# EAGLE design SensorStick (EAGLE 9.6.2)
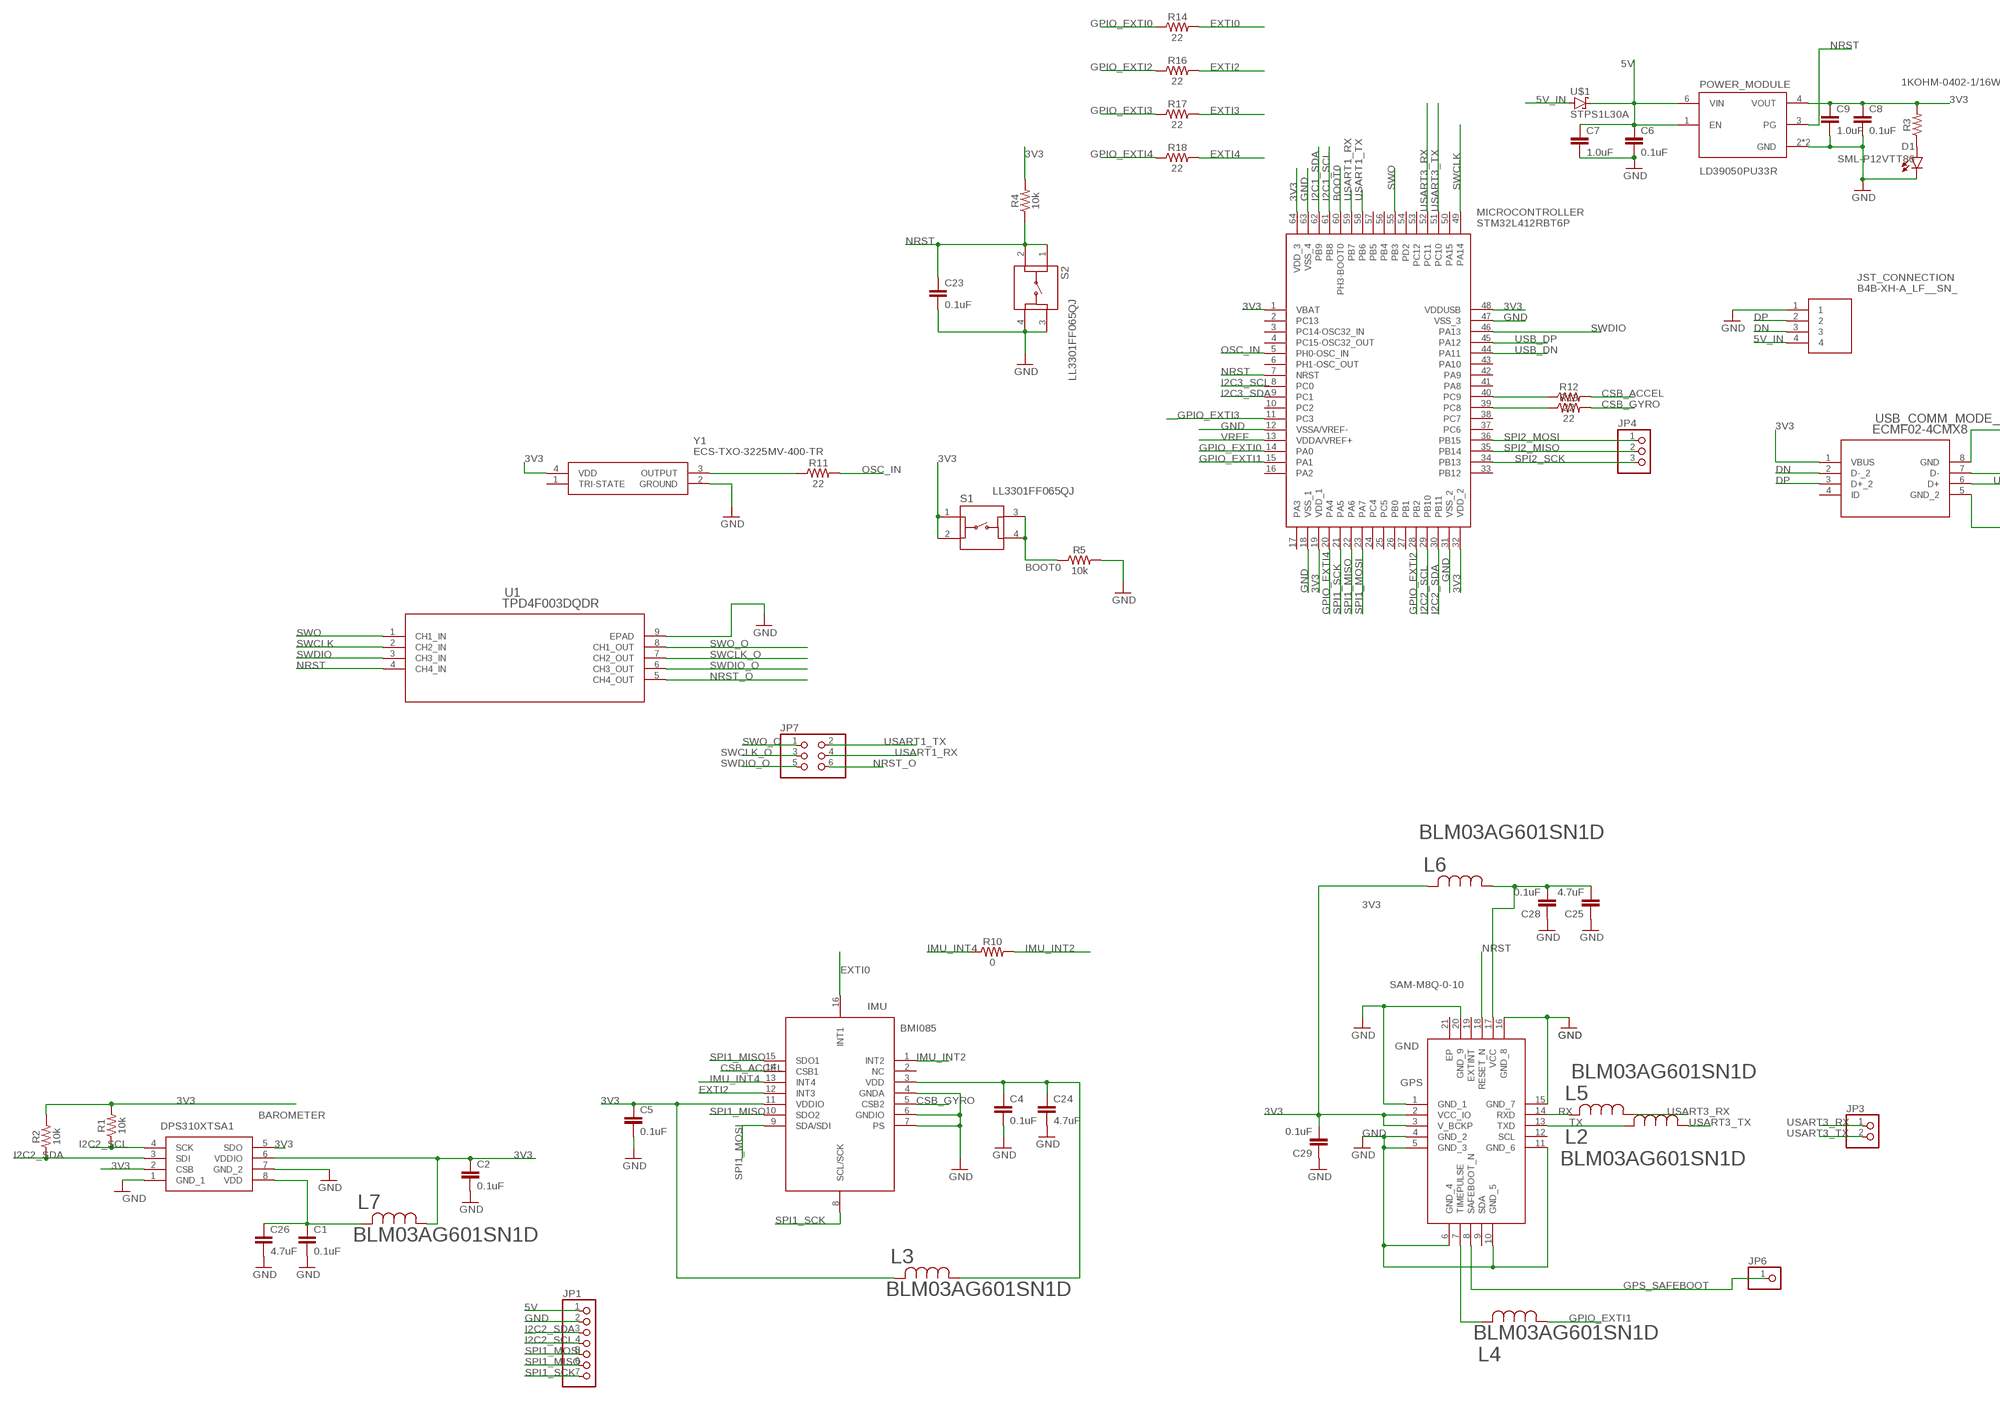
[diagram p0: schematic, sheet 1, part 1 of 2]
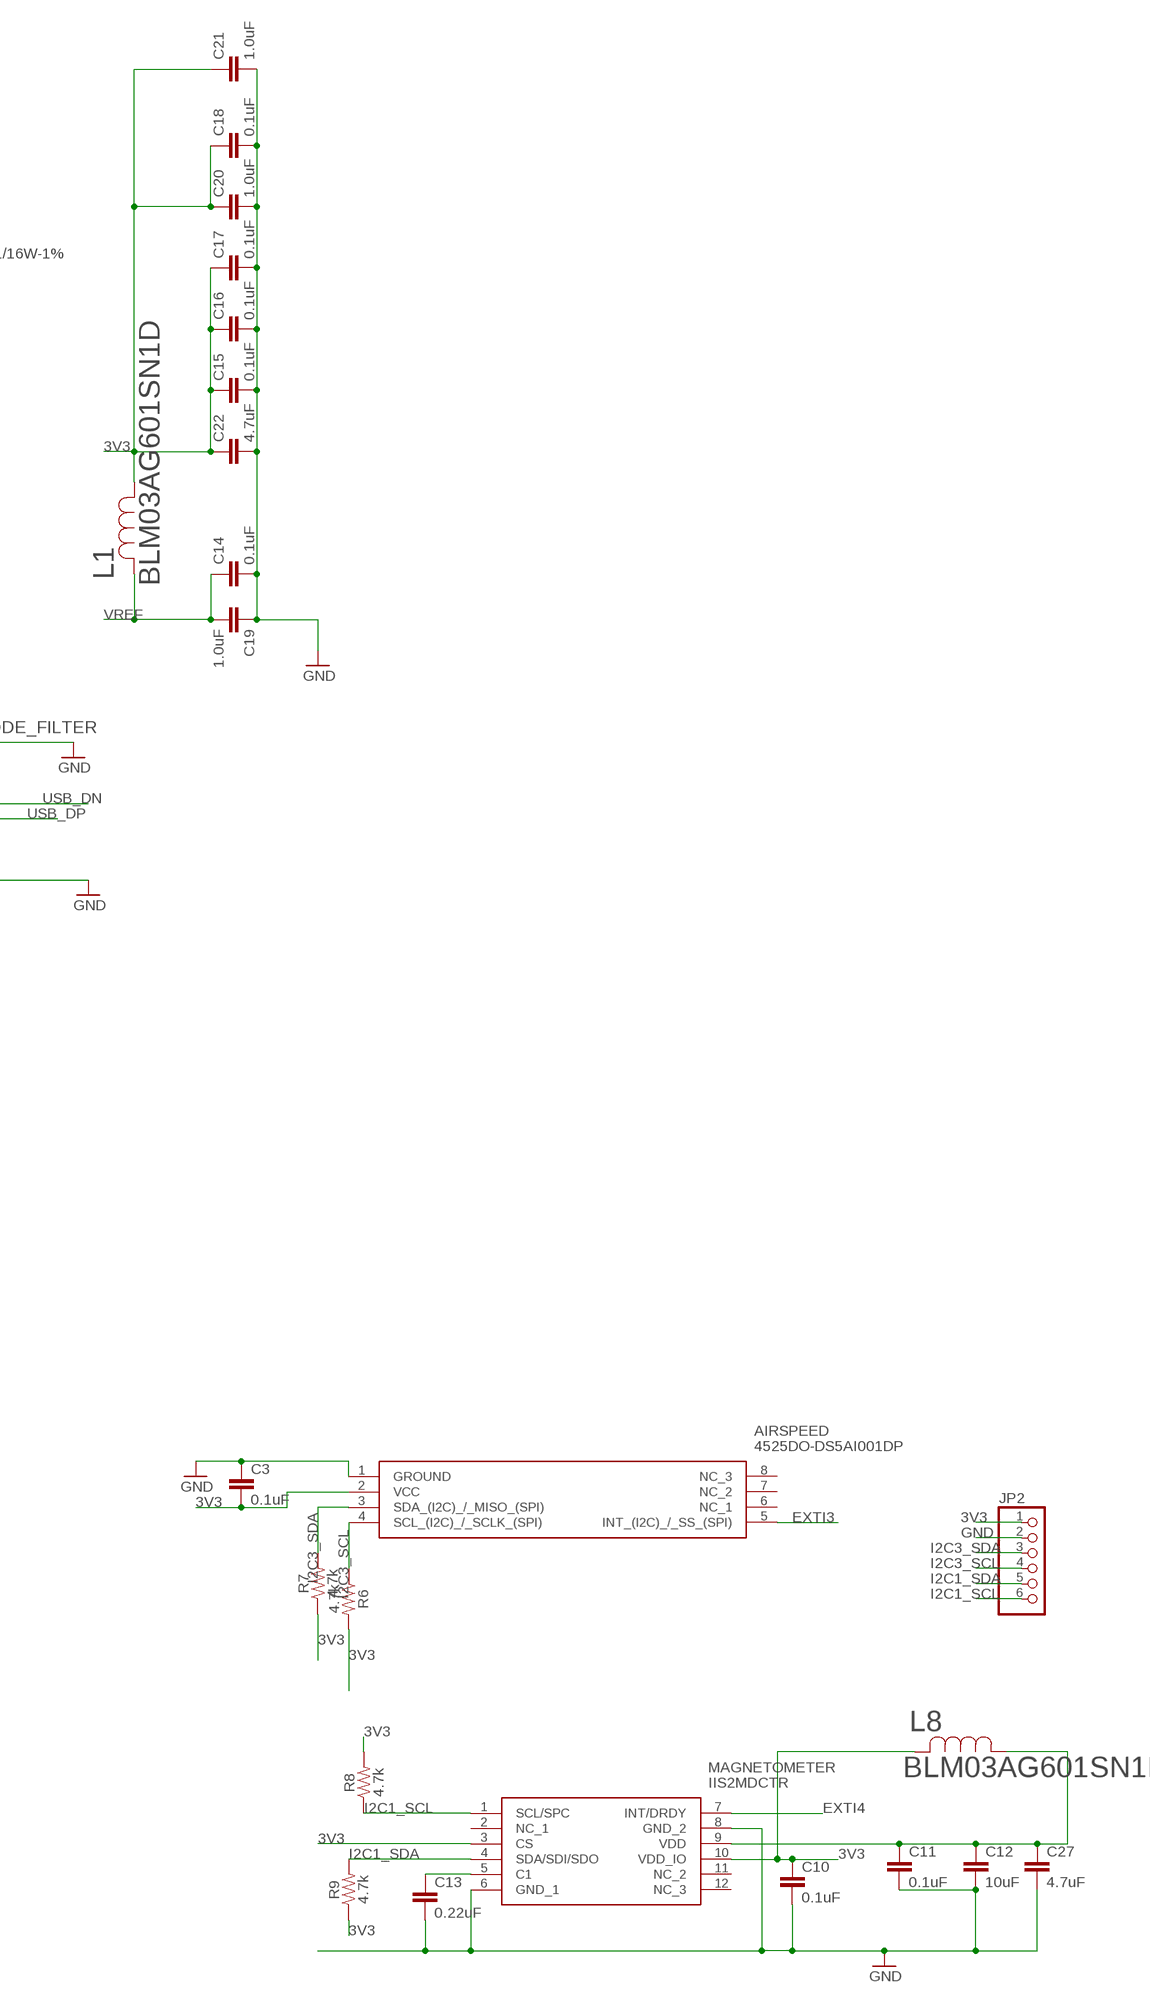
[diagram p1: schematic, sheet 1, part 2 of 2]

## Parts
AIRSPEED  4525DO-DS5AI001DP  [4525DO-DS...P]
BAROMETER  DPS310XTSA1  [DPS310XTSA1]
C1  0.1uF  0.1UF-0402-6.3V-10%-X7R  [0402]
C2  0.1uF  0.1UF-0402-6.3V-10%-X7R  [0402]
C3  0.1uF  0.1UF-0402-6.3V-10%-X7R  [0402]
C4  0.1uF  0.1UF-0402-6.3V-10%-X7R  [0402]
C5  0.1uF  0.1UF-0402-6.3V-10%-X7R  [0402]
C6  0.1uF  0.1UF-0402-6.3V-10%-X7R  [0402]
C7  1.0uF  1.0UF-0402-16V-10%  [0402]
C8  0.1uF  0.1UF-0402-6.3V-10%-X7R  [0402]
C9  1.0uF  1.0UF-0402-16V-10%  [0402]
C10  0.1uF  0.1UF-0402-6.3V-10%-X7R  [0402]
C11  0.1uF  0.1UF-0402-6.3V-10%-X7R  [0402]
C12  10uF  10UF-0603-6.3V-20%  [0603]
C13  0.22uF  0.22UF-0603-25V-10%  [0603]
C14  0.1uF  0.1UF-0603-25V-5%  [0603]
C15  0.1uF  0.1UF-0603-25V-5%  [0603]
C16  0.1uF  0.1UF-0603-25V-5%  [0603]
C17  0.1uF  0.1UF-0603-25V-5%  [0603]
C18  0.1uF  0.1UF-0603-25V-5%  [0603]
C19  1.0uF  1.0UF-0805-25V-10%  [0805]
C20  1.0uF  1.0UF-0805-25V-10%  [0805]
C21  1.0uF  1.0UF-0805-25V-10%  [0805]
C22  4.7uF  4.7UF0603  [0603]
C23  0.1uF  0.1UF-0603-25V-5%  [0603]
C24  4.7uF  4.7UF0603  [0603]
C25  4.7uF  4.7UF0603  [0603]
C26  4.7uF  4.7UF0603  [0603]
C27  4.7uF  4.7UF0603  [0603]
C28  0.1uF  0.1UF-0402-16V-10%  [0402]
C29  0.1uF  0.1UF-0402-16V-10%  [0402]
D1  SML-P12VTT86  [LED_SML-P11UTT86R]
GPS  SAM-M8Q-0-10  [SAMM8Q010]
IMU  BMI085  [BMI085]
JP1  PINHD-1X7  [1X07]
JP2  PINHD-1X6  [1X06]
JP3  PINHD-1X2  [1X02]
JP4  PINHD-1X3  [1X03]
JP6  PINHD-1X1  [1X01]
JP7  PINHD-2X3  [2X03]
JST_CONNECTION  B4B-XH-A_LF__SN_  [B4BXHALFSN]
L1  BLM03AG601SN1D  [IND_BLM03_0201_MUR]
L2  BLM03AG601SN1D  [IND_BLM03_0201_MUR]
L3  BLM03AG601SN1D  [IND_BLM03_0201_MUR]
L4  BLM03AG601SN1D  [IND_BLM03_0201_MUR]
L5  BLM03AG601SN1D  [IND_BLM03_0201_MUR]
L6  BLM03AG601SN1D  [IND_BLM03_0201_MUR]
L7  BLM03AG601SN1D  [IND_BLM03_0201_MUR]
L8  BLM03AG601SN1D  [IND_BLM03_0201_MUR]
MAGNETOMETER  IIS2MDCTR  [IIS2MDCTR]
MICROCONTROLLER  STM32L412RBT6P  [QFP50P1200X1200X160-64N]
POWER_MODULE  LD39050PU33R  [SON95P300X300X100-7N]
R1  10k  10KOHM-0402-1/16W-1%  [0402]
R2  10k  10KOHM-0402-1/16W-1%  [0402]
R3  1KOHM-0402-1/16W-1%  [0402]
R4  10k  10KOHM-0603-1/10W-1%  [0603]
R5  10k  10KOHM-0603-1/10W-1%  [0603]
R6  4.7k  4.7KOHM-0603-1/10W-1%  [0603]
R7  4.7k  4.7KOHM-0603-1/10W-1%  [0603]
R8  4.7k  4.7KOHM-0603-1/10W-1%  [0603]
R9  4.7k  4.7KOHM-0603-1/10W-1%  [0603]
R10  0  0OHM-0603-1/10W-5%  [0603]
R11  22  22OHM-0402-1/10W-1%  [0402]
R12  22  22OHM-0402-1/10W-1%  [0402]
R13  22  22OHM-0402-1/10W-1%  [0402]
R14  22  22OHM-0402-1/10W-1%  [0402]
R16  22  22OHM-0402-1/10W-1%  [0402]
R17  22  22OHM-0402-1/10W-1%  [0402]
R18  22  22OHM-0402-1/10W-1%  [0402]
S1  LL3301FF065QJ  [LL3301FF065QJ]
S2  LL3301FF065QJ  [LL3301FF065QJ]
U1  TPD4F003DQDR  [DQD8_1P2X0P4]
U$1  STPS1L30A  [DIOM5226X223N]
USB_COMM_MODE_FILTER  ECMF02-4CMX8  [MICRO_QFN-8L_STM]
Y1  ECS-TXO-3225MV-400-TR  [ECSTXO3225MV400TR]

## Nets
3V3: AIRSPEED.2(VCC) BAROMETER.2(CSB) BAROMETER.5(SDO) BAROMETER.6(VDDIO) C2.1 C3.2 C5.1 C8.1 C9.1 C10.1 C15.1 C16.1 C17.1 C18.1 C20.1 C21.1 C22.1 C29.2 GPS.2(VCC_IO) GPS.3(V_BCKP) IMU.11(VDDIO) JP2.1 L1.1 L3.2 L6.2 L7.1 L8.2 MAGNETOMETER.3(CS) MAGNETOMETER.10(VDD_IO) MICROCONTROLLER.1(VBAT) MICROCONTROLLER.19(VDD_1) MICROCONTROLLER.32(VDD_2) MICROCONTROLLER.48(VDDUSB) MICROCONTROLLER.64(VDD_3) POWER_MODULE.4(VOUT) R1.2 R2.2 R3.2 R4.2 R6.2 R7.1 R8.2 R9.1 S1.1 S1.2 USB_COMM_MODE_FILTER.1(VBUS) Y1.4(VDD)
5V: C6.1 C7.1 JP1.1 POWER_MODULE.1(EN) POWER_MODULE.6(VIN) U$1.1(C)
5V_IN: JST_CONNECTION.4 U$1.2(A)
BOOT0: MICROCONTROLLER.60(PH3-BOOT0) R5.1 S1.3 S1.4
CSB_ACCEL: IMU.14(CSB1) R12.2
CSB_GYRO: IMU.5(CSB2) R13.2
DN: JST_CONNECTION.3 USB_COMM_MODE_FILTER.2(D-_2)
DP: JST_CONNECTION.2 USB_COMM_MODE_FILTER.3(D+_2)
EXTI0: IMU.16(INT1) R14.2
EXTI2: IMU.12(INT3) R16.2
EXTI3: AIRSPEED.5(INT_(I2C)_/_SS_(SPI)) R17.2
EXTI4: MAGNETOMETER.7(INT/DRDY) R18.2
GND: AIRSPEED.1(GROUND) BAROMETER.1(GND_1) BAROMETER.7(GND_2) C1.2 C2.2 C3.1 C4.2 C5.2 C6.2 C7.2 C8.2 C9.2 C10.2 C11.2 C12.2 C13.2 C14.2 C15.2 C16.2 C17.2 C18.2 C19.1 C20.2 C21.2 C22.2 C23.2 C24.2 C25.1 C26.2 C27.2 C28.1 C29.1 D1.C GPS.1(GND_1) GPS.4(GND_2) GPS.5(GND_3) GPS.6(GND_4) GPS.10(GND_5) GPS.11(GND_6) GPS.15(GND_7) GPS.16(GND_8) GPS.20(GND_9) IMU.4(GNDA) IMU.6(GNDIO) IMU.7(PS) JP1.2 JP2.2 JST_CONNECTION.1 MAGNETOMETER.6(GND_1) MAGNETOMETER.8(GND_2) MICROCONTROLLER.12(VSSA/VREF-) MICROCONTROLLER.18(VSS_1) MICROCONTROLLER.31(VSS_2) MICROCONTROLLER.47(VSS_3) MICROCONTROLLER.63(VSS_4) POWER_MODULE.2(GND) POWER_MODULE.7(GND) R5.2 S2.3 S2.4 U1.9(EPAD) USB_COMM_MODE_FILTER.5(GND_2) USB_COMM_MODE_FILTER.8(GND) Y1.2(GROUND)
GPIO_EXTI0: MICROCONTROLLER.14(PA0) R14.1
GPIO_EXTI1: L4.1 MICROCONTROLLER.15(PA1)
GPIO_EXTI2: MICROCONTROLLER.28(PB2) R16.1
GPIO_EXTI3: MICROCONTROLLER.11(PC3) R17.1
GPIO_EXTI4: MICROCONTROLLER.20(PA4) R18.1
GPS_SAFEBOOT: GPS.8(SAFEBOOT_N) JP6.1
I2C1_SCL: JP2.6 MAGNETOMETER.1(SCL/SPC) MICROCONTROLLER.61(PB8) R8.1
I2C1_SDA: JP2.5 MAGNETOMETER.4(SDA/SDI/SDO) MICROCONTROLLER.62(PB9) R9.2
I2C2_SCL: BAROMETER.4(SCK) JP1.4 MICROCONTROLLER.29(PB10) R1.1
I2C2_SDA: BAROMETER.3(SDI) JP1.3 MICROCONTROLLER.30(PB11) R2.1
I2C3_SCL: AIRSPEED.4(SCL_(I2C)_/_SCLK_(SPI)) JP2.4 MICROCONTROLLER.8(PC0) R6.1
I2C3_SDA: AIRSPEED.3(SDA_(I2C)_/_MISO_(SPI)) JP2.3 MICROCONTROLLER.9(PC1) R7.2
IMU_INT2: IMU.1(INT2) R10.2
IMU_INT4: IMU.13(INT4) R10.1
N$1: R11.1 Y1.3(OUTPUT)
N$2: GPS.7(TIMEPULSE) L4.2
N$3: MICROCONTROLLER.40(PC9) R12.1
N$4: MICROCONTROLLER.39(PC8) R13.1
N$5: D1.A R3.1
N$6: BAROMETER.8(VDD) C1.1 C26.1 L7.2
N$7: C13.1 MAGNETOMETER.5(C1)
N$8: C4.1 C24.1 IMU.3(VDD) L3.1
N$9: C25.2 C28.2 GPS.17(VCC) L6.1
N$10: C11.1 C12.1 C27.1 L8.1 MAGNETOMETER.9(VDD)
NRST: C23.1 GPS.18(RESET_N) MICROCONTROLLER.7(NRST) POWER_MODULE.3(PG) R4.1 S2.1 S2.2 U1.4(CH4_IN)
NRST_O: JP7.6 U1.5(CH4_OUT)
OSC_IN: MICROCONTROLLER.5(PH0-OSC_IN) R11.2
RX: GPS.14(RXD) L5.2
SPI1_MISO: IMU.10(SDO2) IMU.15(SDO1) JP1.6 MICROCONTROLLER.22(PA6)
SPI1_MOSI: IMU.9(SDA/SDI) JP1.5 MICROCONTROLLER.23(PA7)
SPI1_SCK: IMU.8(SCL/SCK) JP1.7 MICROCONTROLLER.21(PA5)
SPI2_MISO: JP4.2 MICROCONTROLLER.35(PB14)
SPI2_MOSI: JP4.1 MICROCONTROLLER.36(PB15)
SPI2_SCK: JP4.3 MICROCONTROLLER.34(PB13)
SWCLK: MICROCONTROLLER.49(PA14) U1.2(CH2_IN)
SWCLK_O: JP7.3 U1.7(CH2_OUT)
SWDIO: MICROCONTROLLER.46(PA13) U1.3(CH3_IN)
SWDIO_O: JP7.5 U1.6(CH3_OUT)
SWO: MICROCONTROLLER.55(PB3) U1.1(CH1_IN)
SWO_O: JP7.1 U1.8(CH1_OUT)
TX: GPS.13(TXD) L2.2
USART1_RX: JP7.4 MICROCONTROLLER.59(PB7)
USART1_TX: JP7.2 MICROCONTROLLER.58(PB6)
USART3_RX: JP3.1 L5.1 MICROCONTROLLER.52(PC11)
USART3_TX: JP3.2 L2.1 MICROCONTROLLER.51(PC10)
USB_DN: MICROCONTROLLER.44(PA11) USB_COMM_MODE_FILTER.7(D-)
USB_DP: MICROCONTROLLER.45(PA12) USB_COMM_MODE_FILTER.6(D+)
VREF: C14.1 C19.2 L1.2 MICROCONTROLLER.13(VDDA/VREF+)
Unconnected: AIRSPEED.6(NC_1) AIRSPEED.7(NC_2) AIRSPEED.8(NC_3) GPS.9(SDA) GPS.12(SCL) GPS.19(EXTINT) GPS.21(EP) IMU.2(NC) MAGNETOMETER.2(NC_1) MAGNETOMETER.11(NC_2) MAGNETOMETER.12(NC_3) MICROCONTROLLER.2(PC13) MICROCONTROLLER.3(PC14-OSC32_IN) MICROCONTROLLER.4(PC15-OSC32_OUT) MICROCONTROLLER.6(PH1-OSC_OUT) MICROCONTROLLER.10(PC2) MICROCONTROLLER.16(PA2) MICROCONTROLLER.17(PA3) MICROCONTROLLER.24(PC4) MICROCONTROLLER.25(PC5) MICROCONTROLLER.26(PB0) MICROCONTROLLER.27(PB1) MICROCONTROLLER.33(PB12) MICROCONTROLLER.37(PC6) MICROCONTROLLER.38(PC7) MICROCONTROLLER.41(PA8) MICROCONTROLLER.42(PA9) MICROCONTROLLER.43(PA10) MICROCONTROLLER.50(PA15) MICROCONTROLLER.53(PC12) MICROCONTROLLER.54(PD2) MICROCONTROLLER.56(PB4) MICROCONTROLLER.57(PB5) USB_COMM_MODE_FILTER.4(ID) Y1.1(TRI-STATE)

## Library data of the parts
AIRSPEED = 4525DO-DS5AI001DP:4525DO-DS5AI001DP: Differential Pressure Sensor 1PSI Dual Barbs Source: Datasheet <http://www.te.com/commerce/DocumentDelivery/DDEController?Action=srchrtrv&DocNm=MS4525DO&DocType=DS&DocLang=English>; ARROW_PART_NUMBER: 4525DO-DS5AI001DP; ARROW_PRICE-STOCK: https://www.arrow.com/en/products/4525do-ds5ai001dp/te-connectivity; DESCRIPTION: Differential Pressure Sensor 1PSI Dual Barbs; HEIGHT: mm; MANUFACTURER_NAME: TE Connectivity; MANUFACTURER_PART_NUMBER: 4525DO-DS5AI001DP; MOUSER_PART_NUMBER: 824-4525DODS5AI001DP; MOUSER_PRICE-STOCK: https://www.mouser.co.uk/ProductDetail/Measurement-Specialties/4525DO-DS5AI001DP?qs=oFx6pF86PmDUpUCTX7loEA%3D%3D
BAROMETER = DPS310XTSA1:DPS310XTSA1: INFINEON - DPS310XTSA1 - DIGITAL PRESSURE SENSOR, 1200HPA, VLGA-8 Source: Datasheet <https://www.infineon.com/dgdl/Infineon-DPS310-DS-v01_00-EN.pdf?fileId=5546d462576f34750157750826c42242>; ARROW_PART_NUMBER: DPS310XTSA1; ARROW_PRICE-STOCK: https://www.arrow.com/en/products/dps310xtsa1/infineon-technologies-ag?region=nac; DESCRIPTION: INFINEON - DPS310XTSA1 - DIGITAL PRESSURE SENSOR, 1200HPA, VLGA-8; HEIGHT: 1.01mm; MANUFACTURER_NAME: Infineon; MANUFACTURER_PART_NUMBER: DPS310XTSA1; MOUSER_PART_NUMBER: 726-DPS310XTSA1; MOUSER_PRICE-STOCK: https://www.mouser.co.uk/ProductDetail/Infineon-Technologies/DPS310XTSA1?qs=uuTTuBTXn66Ynca8WHwycg%3D%3D
C1 C2 C4-C6 C8 C10 C11 = SparkFun-Capacitors:0.1UF: 0.1µF ceramic capacitors A capacitor is a passive two-terminal electrical component used to store electrical energy temporarily in an electric field.; PROD_ID: CAP-14993
C3 = SparkFun-Capacitors:0.1UF: 0.1µF ceramic capacitors A capacitor is a passive two-terminal electrical component used to store electrical energy temporarily in an electric field.; PROD_ID: CAP-14993; SPICEPREFIX: C
C7 C9 = SparkFun-Capacitors:1.0UF: 1µF ceramic capacitors A capacitor is a passive two-terminal electrical component used to store electrical energy temporarily in an electric field.; PROD_ID: CAP-12417
C12 = SparkFun-Capacitors:10UF: 10.0µF ceramic capacitors A capacitor is a passive two-terminal electrical component used to store electrical energy temporarily in an electric field.; PROD_ID: CAP-11015
C13 = SparkFun-Capacitors:0.22UF: 0.22µF ceramic capacitors A capacitor is a passive two-terminal electrical component used to store electrical energy temporarily in an electric field.; PROD_ID: CAP-07822
C14-C18 C23 = SparkFun-Capacitors:0.1UF: 0.1µF ceramic capacitors A capacitor is a passive two-terminal electrical component used to store electrical energy temporarily in an electric field.; PROD_ID: CAP-08604
C19-C21 = SparkFun-Capacitors:1.0UF: 1µF ceramic capacitors A capacitor is a passive two-terminal electrical component used to store electrical energy temporarily in an electric field.; PROD_ID: CAP-08064
C22 C24-C27 = SparkFun-Capacitors:4.7UF: 4.7µF ceramic capacitors A capacitor is a passive two-terminal electrical component used to store electrical energy temporarily in an electric field.; PROD_ID: CAP-08280
C28 C29 = SparkFun-Capacitors:0.1UF: 0.1µF ceramic capacitors A capacitor is a passive two-terminal electrical component used to store electrical energy temporarily in an electric field.; PROD_ID: CAP-12416
D1 = ce-capstone:SML-P12VTT86: SML-P1 Series Red 0402 Clear 60 mcd 2 V Surface Mount PICOLED LED; AVAILABILITY: Unavailable; DESCRIPTION: Red 630nm LED Indication - Discrete 2V 0402 _1006 Metric_; MF: Rohm; MP: SML-P12VTT86; PACKAGE: 0402 Rohm; PRICE: None
GPS = SAM-M8Q-0-10:SAM-M8Q-0-10: GNSS antenna module Source: Datasheet <https://www.u-blox.com/sites/default/files/SAM-M8Q_DataSheet_(UBX-16012619).pdf>; DESCRIPTION: GNSS antenna module; HEIGHT: 3mm; MANUFACTURER_NAME: U-Blox; MANUFACTURER_PART_NUMBER: SAM-M8Q-0-10; MOUSER_PART_NUMBER: N/A; MOUSER_PRICE-STOCK: https://www.mouser.co.uk/ProductDetail/u-blox/SAM-M8Q-0-10?qs=KUoIvG%2F9IlYKGQbFkOKljQ%3D%3D
IMU = BMI085:BMI085: IMUs - Inertial Measurement Units High-performance IMU BMI085 for virtual and augmented reality applications Source: Datasheet <https://ae-bst.resource.bosch.com/media/_tech/media/datasheets/BST-BMI085-DS001.pdf>; ARROW_PART_NUMBER: BMI085; ARROW_PRICE-STOCK: https://www.arrow.com/en/products/bmi085/bosch; DESCRIPTION: IMUs - Inertial Measurement Units High-performance IMU BMI085 for virtual and augmented reality applications; HEIGHT: 1mm; MANUFACTURER_NAME: Bosch Sensortec; MANUFACTURER_PART_NUMBER: BMI085; MOUSER_PART_NUMBER: 262-BMI085; MOUSER_PRICE-STOCK: https://www.mouser.co.uk/ProductDetail/Bosch-Sensortec/BMI085?qs=y6ZabgHbY%252ByGCM8LfWZyqA%3D%3D
JP1 = pinhead:PINHD-1X7: PIN HEADER
JP2 = pinhead:PINHD-1X6: PIN HEADER
JP3 = pinhead:PINHD-1X2: PIN HEADER
JP4 = pinhead:PINHD-1X3: PIN HEADER
JP6 = pinhead:PINHD-1X1: PIN HEADER
JP7 = pinhead:PINHD-2X3: PIN HEADER
JST_CONNECTION = B4B-XH-A_LF__SN_:B4B-XH-A_LF__SN_: CONN HEADER VERT 4POS 2.5MM Source: Datasheet <https://datasheet.lcsc.com/szlcsc/JST-Sales-America-B4B-XH-A-LF-SN_C144395.pdf>; ARROW_PART_NUMBER: B4B-XH-A(LF)(SN); ARROW_PRICE-STOCK: https://www.arrow.com/en/products/b4b-xh-a-lf-sn/jst-manufacturing?region=europe; DESCRIPTION: CONN HEADER VERT 4POS 2.5MM; HEIGHT: 7mm; MANUFACTURER_NAME: JST (JAPAN SOLDERLESS TERMINALS); MANUFACTURER_PART_NUMBER: B4B-XH-A(LF)(SN)
L1-L8 = BLM03AG601SN1D:BLM03AG601SN1D; COPYRIGHT: Copyright (C) 2023 Ultra Librarian. All rights reserved.; DIGI-KEY_PART_NUMBER_1: 490-5164-1-ND; DIGI-KEY_PART_NUMBER_2: 490-5164-2-ND; DIGI-KEY_PART_NUMBER_3: 490-5164-6-ND; MANUFACTURER_PART_NUMBER: BLM03AG601SN1D; MFR_NAME: Murata
MAGNETOMETER = IIS2MDCTR:IIS2MDCTR: STMICROELECTRONICS - IIS2MDCTR - MEMS MODULE, 3-AXIS MAGNETOMETER, LGA-12 Source: Datasheet <https://www.st.com/resource/en/datasheet/iis2mdc.pdf>; ARROW_PART_NUMBER: IIS2MDCTR; ARROW_PRICE-STOCK: https://www.arrow.com/en/products/iis2mdctr/stmicroelectronics; DESCRIPTION: STMICROELECTRONICS - IIS2MDCTR - MEMS MODULE, 3-AXIS MAGNETOMETER, LGA-12; HEIGHT: 0.7mm; MANUFACTURER_NAME: STMicroelectronics; MANUFACTURER_PART_NUMBER: IIS2MDCTR; MOUSER_PART_NUMBER: 511-IIS2MDCTR; MOUSER_PRICE-STOCK: https://www.mouser.co.uk/ProductDetail/STMicroelectronics/IIS2MDCTR?qs=1mbolxNpo8ems1K%2FRdQzXg%3D%3D
MICROCONTROLLER = STM32L412RBT6P:STM32L412RBT6P: ARM Microcontrollers - MCU Source: Datasheet <https://www.st.com/resource/en/datasheet/stm32l412c8.pdf>; DESCRIPTION: ARM Microcontrollers - MCU; HEIGHT: 1.6mm; MANUFACTURER_NAME: STMicroelectronics; MANUFACTURER_PART_NUMBER: STM32L412RBT6P; MOUSER_PART_NUMBER: 511-STM32L412RBT6P; MOUSER_PRICE-STOCK: https://www.mouser.co.uk/ProductDetail/STMicroelectronics/STM32L412RBT6P?qs=l7cgNqFNU1hh%252BU1wOZs5Xg%3D%3D
POWER_MODULE = ce-capstone:LD39050PU33R: LD39050 Series 500 mA 3.3 V Fixed Low Noise LDO Voltage Regulator - DFN-6; AVAILABILITY: Unavailable; DESCRIPTION: Linear Voltage Regulator IC 1 Output 500mA 6-DFN _3x3_; MF: STMicroelectronics; MP: LD39050PU33R; PACKAGE: DFN-6 STMicroelectronics; PRICE: None
R1 R2 = SparkFun-Resistors:10KOHM: 10kΩ resistor A resistor is a passive two-terminal electrical component that implements electrical resistance as a circuit element. Resistors act to reduce current flow, and, at the same time, act to lower voltage levels within circuits. - Wikipedia; PROD_ID: RES-14241
R3 = SparkFun-Resistors:1KOHM: 1kΩ resistor A resistor is a passive two-terminal electrical component that implements electrical resistance as a circuit element. Resistors act to reduce current flow, and, at the same time, act to lower voltage levels within circuits. - Wikipedia; PROD_ID: RES-14342
R4 R5 = SparkFun-Resistors:10KOHM: 10kΩ resistor A resistor is a passive two-terminal electrical component that implements electrical resistance as a circuit element. Resistors act to reduce current flow, and, at the same time, act to lower voltage levels within circuits. - Wikipedia; PROD_ID: RES-00824
R6-R9 = SparkFun-Resistors:4.7KOHM: 4.7kΩ resistor A resistor is a passive two-terminal electrical component that implements electrical resistance as a circuit element. Resistors act to reduce current flow, and, at the same time, act to lower voltage levels within circuits. - Wikipedia; PROD_ID: RES-07857
R10 = SparkFun-Resistors:0OHM: 0Ω resistor A resistor is a passive two-terminal electrical component that implements electrical resistance as a circuit element. Resistors act to reduce current flow, and, at the same time, act to lower voltage levels within circuits. - Wikipedia; PROD_ID: RES-08609
R11-R14 R16-R18 = SparkFun-Resistors:22OHM: 22Ω resistor A resistor is a passive two-terminal electrical component that implements electrical resistance as a circuit element. Resistors act to reduce current flow, and, at the same time, act to lower voltage levels within circuits. - Wikipedia; PROD_ID: RES-12427
S1 S2 = ce-capstone:LL3301FF065QJ: Pushbutton Switches 50mA 12VDC F065 7.0mm J-Lead Source: Datasheet <https://componentsearchengine.com/Datasheets/1/LL3301FF065QJ.pdf>; DESCRIPTION: Pushbutton Switches 50mA 12VDC F065 7.0mm J-Lead; HEIGHT: 7.3mm; MANUFACTURER_NAME: E-Switch; MANUFACTURER_PART_NUMBER: LL3301FF065QJ; MOUSER_PART_NUMBER: 612-LL3301FF065QJ; MOUSER_PRICE-STOCK: https://www.mouser.com/Search/Refine.aspx?Keyword=612-LL3301FF065QJ
U1 = TPD4F003DQDR:TPD4F003DQDR; COPYRIGHT: Copyright (C) 2023 Ultra Librarian. All rights reserved.; DIGI-KEY_PART_NUMBER_1: 296-25817-1-ND; DIGI-KEY_PART_NUMBER_2: 296-25817-2-ND; DIGI-KEY_PART_NUMBER_3: 296-25817-6-ND; DIGI-KEY_PART_NUMBER_4: 2156-TPD4F003DQDR-ND; MANUFACTURER_PART_NUMBER: TPD4F003DQDR; MFR_NAME: Texas Instruments
U$1 = ce-capstone:STPS1L30A
USB_COMM_MODE_FILTER = ECMF02-4CMX8:ECMF02-4CMX8; COPYRIGHT: Copyright (C) 2023 Ultra Librarian. All rights reserved.; DIGI-KEY_PART_NUMBER_1: 497-13420-2-ND; DIGI-KEY_PART_NUMBER_2: 497-13420-1-ND; DIGI-KEY_PART_NUMBER_3: 497-13420-6-ND; MANUFACTURER_PART_NUMBER: ECMF02-4CMX8; MFR_NAME: STMicroelectronics
Y1 = SamacSys_Parts:ECS-TXO-3225MV-400-TR: TCXO Oscillators 40.000 MHZ Multi-Volt +1.7 3.6V HCMOS TCXO +/-2.5 ppm -30 +85 C 3.2x 2.5mm RoHS Source: Datasheet <https://ecsxtal.com/store/pdf/ECS-TXO-3225MV.pdf>; DESCRIPTION: TCXO Oscillators 40.000 MHZ Multi-Volt +1.7 3.6V HCMOS TCXO +/-2.5 ppm -30 +85 C 3.2x 2.5mm RoHS; HEIGHT: 1.2mm; MANUFACTURER_NAME: ECS; MANUFACTURER_PART_NUMBER: ECS-TXO-3225MV-400-TR

## Board
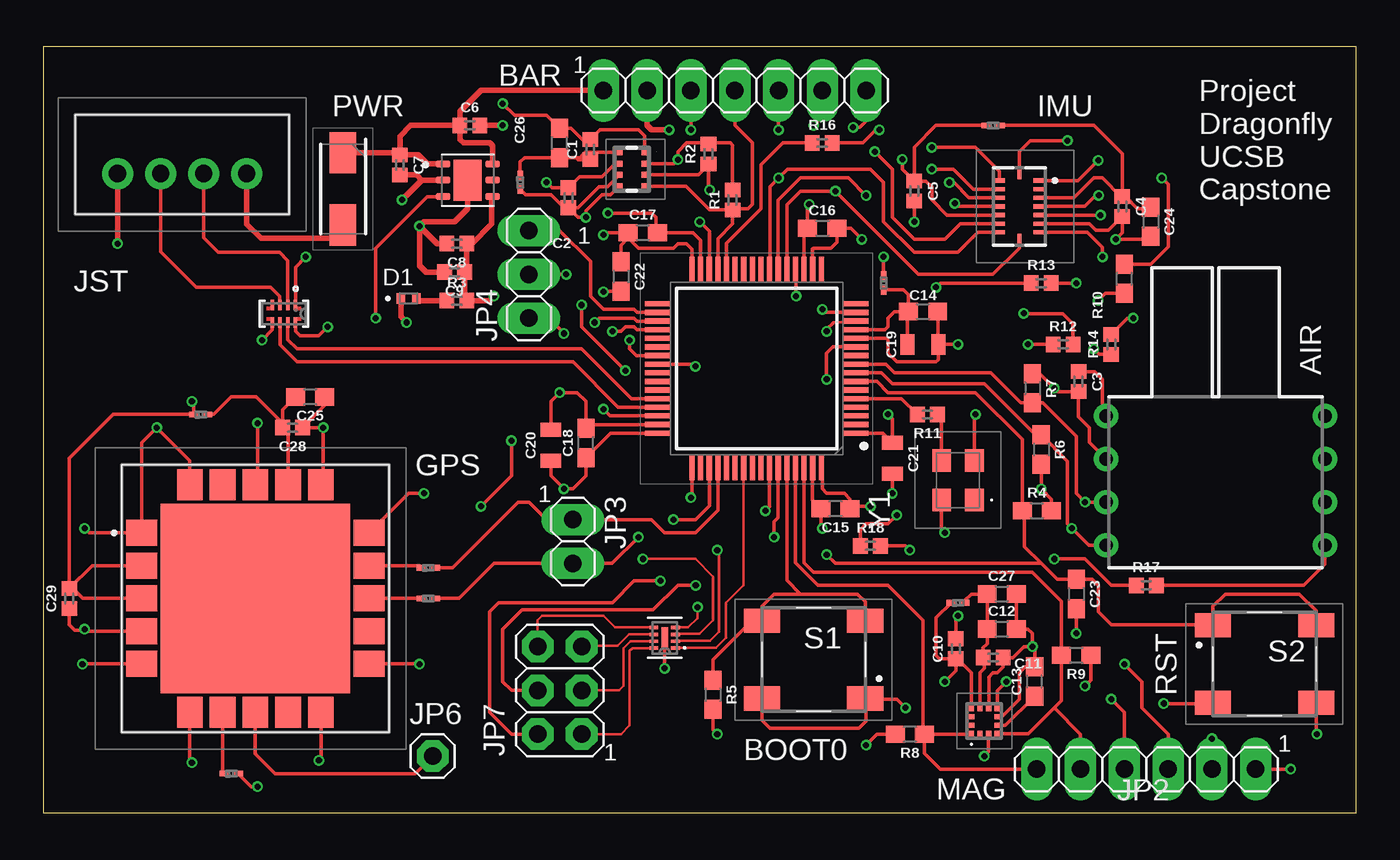
[diagram p2: board, top side]
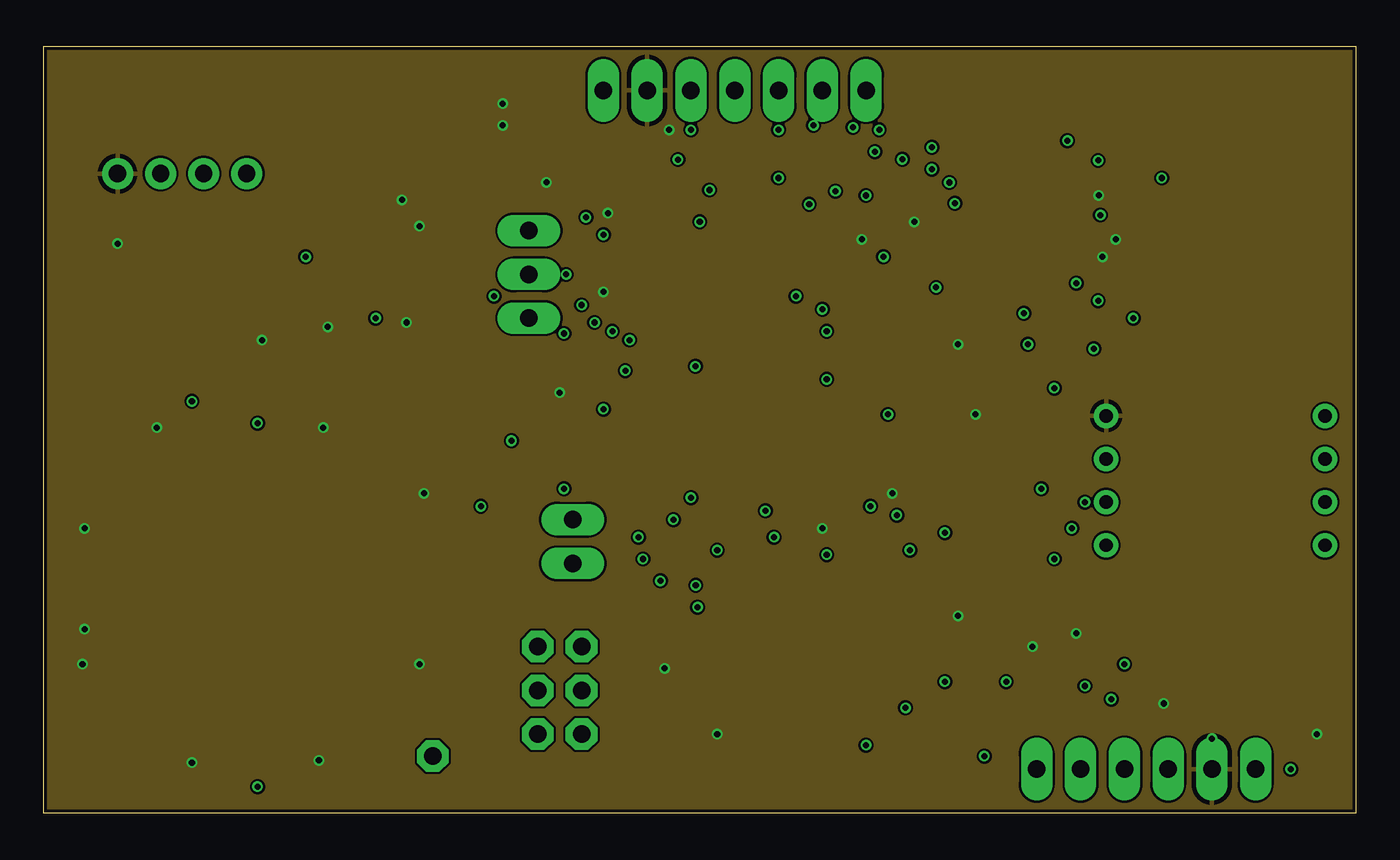
[diagram p3: board, inner layer Route2]
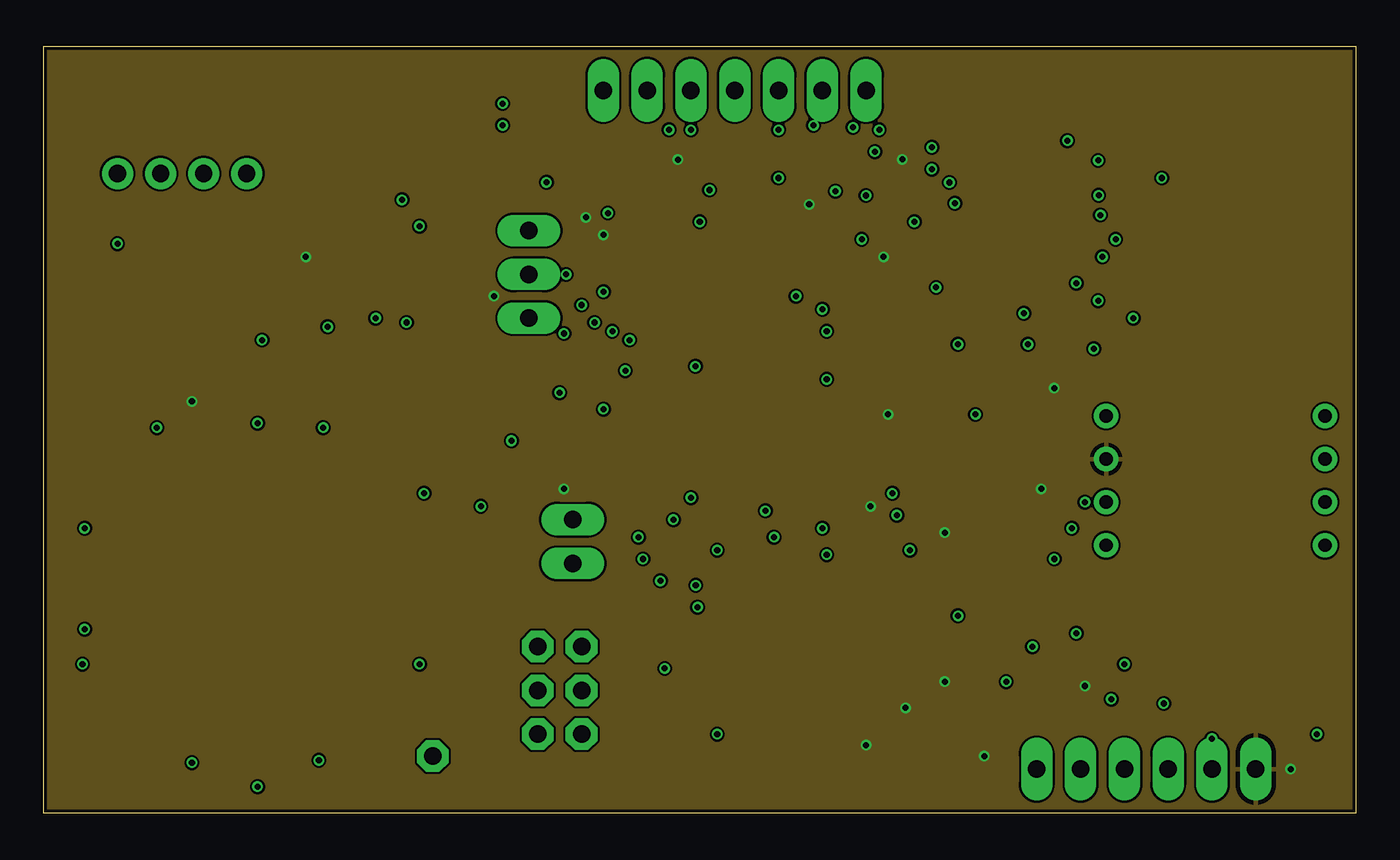
[diagram p4: board, inner layer Route15]
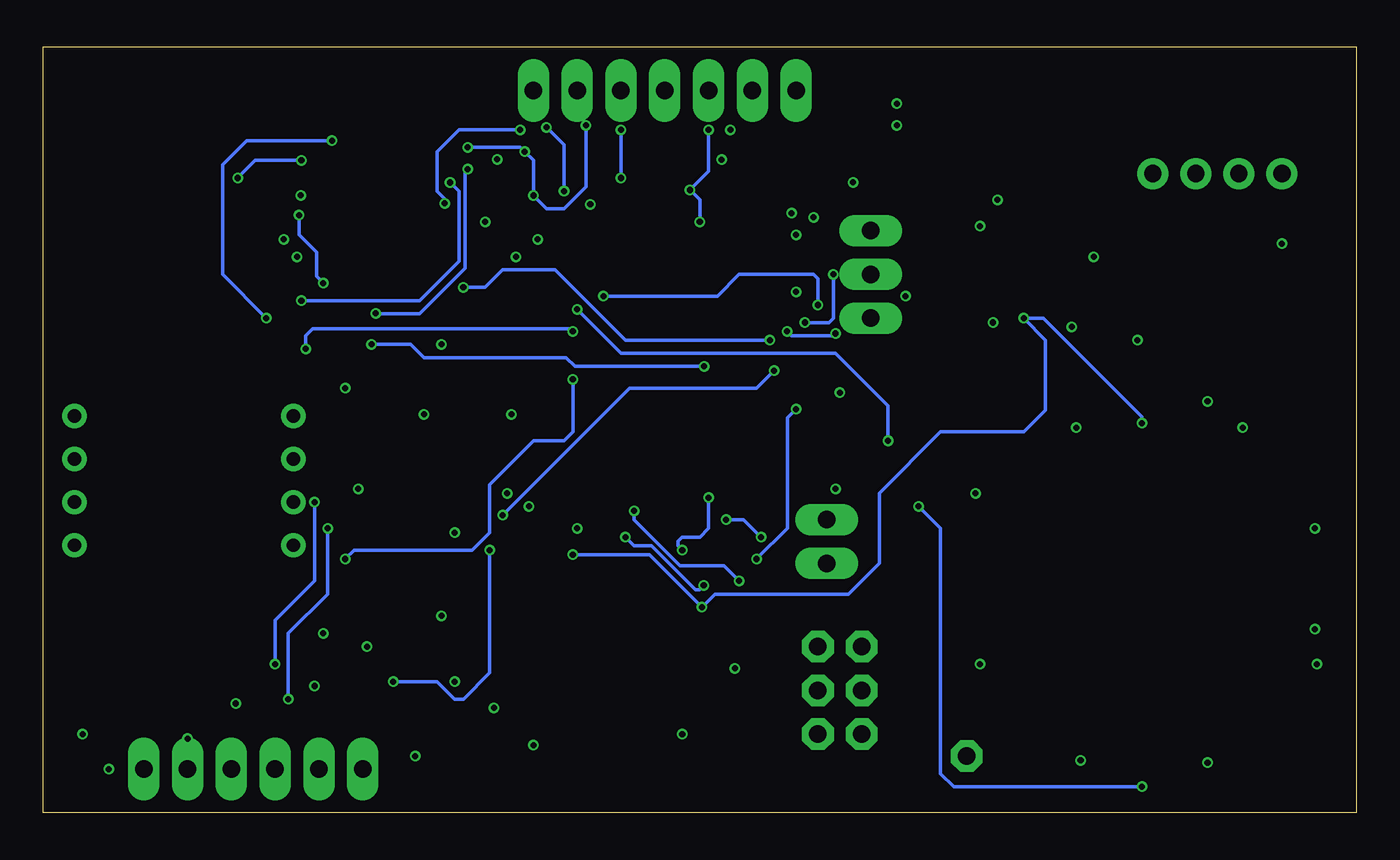
[diagram p5: board, bottom side, seen from below]

Size 76.2 x 44.45 mm. Coordinates in mm from the lower left corner, seen from the top.
Outline: 0,0 76.2,0 76.2,44.45 0,44.45 0,0
Copper layers (1+2*15+16): Top 0.035mm / dielectric 0.2mm / Route2 0.0175mm / dielectric 1.065mm / Route15 0.0175mm / dielectric 0.2mm / Bottom 0.035mm
Design rules "jlcpcb-4layers": minimum track width 3.5mil, minimum drill 0.2mm, track to track 5mil, track to pad 0.2mm, pad to pad 5mil, via to via 0.5mm, smd to smd 5mil, copper to edge 0.2mm, drill to drill 6mil, minimum pad ring 10mil, minimum via ring 0.13mm, stop-mask expansion 0.05mm, vias tented up to drill 16mil, thermal gap 10mil

### Footprints (pad centres in the part's own frame; a part is rotated, then mirrored left to right if it is on the bottom)
4525DO-DS...P = drill 0.78 pad 1.28: 1 1.1,-8.3; 2 3.6,-8.3; 3 6.1,-8.3; 4 8.6,-8.3; 5 8.6,4.4; 6 6.1,4.4; 7 3.6,4.4; 8 1.1,4.4
DPS310XTSA1 = smd 0.35 x 0.35: 1 0.975,-0.725; 2 0.325,-0.725; 3 -0.325,-0.725; 4 -0.975,-0.725; 5 -0.975,0.725; 6 -0.325,0.725; 7 0.325,0.725; 8 0.975,0.725
0402 = smd 0.85 x 0.9: 1 -0.58,0; 2 0.58,0
0603 = smd 1.1 x 1: 1 -0.85,0; 2 0.85,0
0805 = smd 0.8 x 1.2: 1 -0.9,0; 2 0.9,0
LED_SML-P11UTT86R = smd 0.5 x 0.6: A 0.45,0; C -0.45,0
SAMM8Q010 = smd 1.8 x 1.5: 1 -6.6,3.8; 2 -6.6,1.9; 3 -6.6,0; 4 -6.6,-1.9; 5 -6.6,-3.8; 11 6.6,-3.8; 12 6.6,-1.9; 13 6.6,0; 14 6.6,1.9; 15 6.6,3.8 | smd 1.5 x 1.8: 6 -3.8,-6.6; 7 -1.9,-6.6; 8 0,-6.6; 9 1.9,-6.6; 10 3.8,-6.6; 16 3.8,6.6; 17 1.9,6.6; 18 0,6.6; 19 -1.9,6.6; 20 -3.8,6.6 | smd 11 x 11: 21 0,0
BMI085 = smd 0.675 x 0.25: 1 1.165,1.5; 2 1.165,1; 3 1.165,0.5; 4 1.165,0; 5 1.165,-0.5; 6 1.165,-1; 7 1.165,-1.5; 9 -1.165,-1.5; 10 -1.165,-1; 11 -1.165,-0.5; 12 -1.165,0; 13 -1.165,0.5; 14 -1.165,1; 15 -1.165,1.5 | smd 0.25 x 0.675: 8 0,-1.915; 16 0,1.915
1X07 = drill 1.016 long: 1 -7.62,0; 2 -5.08,0; 3 -2.54,0; 4 0,0; 5 2.54,0; 6 5.08,0; 7 7.62,0
1X06 = drill 1.016 long: 1 -6.35,0; 2 -3.81,0; 3 -1.27,0; 4 1.27,0; 5 3.81,0; 6 6.35,0
1X02 = drill 1.016 long: 1 -1.27,0; 2 1.27,0
1X03 = drill 1.016 long: 1 -2.54,0; 2 0,0; 3 2.54,0
1X01 = drill 1.016 octagon: 1 0,0
2X03 = drill 1.016 octagon: 1 -2.54,-1.27; 2 -2.54,1.27; 3 0,-1.27; 4 0,1.27; 5 2.54,-1.27; 6 2.54,1.27
B4BXHALFSN = drill 1 pad 1.5: 1 0,0; 2 2.5,0; 3 5,0; 4 7.5,0
IND_BLM03_0201_MUR = smd 0.559 x 0.33: 1 -0.394,0; 2 0.394,0
IIS2MDCTR = smd 0.35 x 0.3: 1 -0.75,0.75; 2 -0.75,0.25; 3 -0.75,-0.25; 4 -0.75,-0.75; 7 0.75,-0.75; 8 0.75,-0.25; 9 0.75,0.25; 10 0.75,0.75 | smd 0.3 x 0.35: 5 -0.25,-0.75; 6 0.25,-0.75; 11 0.25,0.75; 12 -0.25,0.75
QFP50P1200X1200X160-64N = smd 1.475 x 0.3: 1 -5.738,3.75; 2 -5.738,3.25; 3 -5.738,2.75; 4 -5.738,2.25; 5 -5.738,1.75; 6 -5.738,1.25; 7 -5.738,0.75; 8 -5.738,0.25; 9 -5.738,-0.25; 10 -5.738,-0.75; 11 -5.738,-1.25; 12 -5.738,-1.75; 13 -5.738,-2.25; 14 -5.738,-2.75; 15 -5.738,-3.25; 16 -5.738,-3.75; 33 5.738,-3.75; 34 5.738,-3.25; 35 5.738,-2.75; 36 5.738,-2.25; 37 5.738,-1.75; 38 5.738,-1.25; 39 5.738,-0.75; 40 5.738,-0.25; 41 5.738,0.25; 42 5.738,0.75; 43 5.738,1.25; 44 5.738,1.75; 45 5.738,2.25; 46 5.738,2.75; 47 5.738,3.25; 48 5.738,3.75 | smd 0.3 x 1.475: 17 -3.75,-5.738; 18 -3.25,-5.738; 19 -2.75,-5.738; 20 -2.25,-5.738; 21 -1.75,-5.738; 22 -1.25,-5.738; 23 -0.75,-5.738; 24 -0.25,-5.738; 25 0.25,-5.738; 26 0.75,-5.738; 27 1.25,-5.738; 28 1.75,-5.738; 29 2.25,-5.738; 30 2.75,-5.738; 31 3.25,-5.738; 32 3.75,-5.738; 49 3.75,5.738; 50 3.25,5.738; 51 2.75,5.738; 52 2.25,5.738; 53 1.75,5.738; 54 1.25,5.738; 55 0.75,5.738; 56 0.25,5.738; 57 -0.25,5.738; 58 -0.75,5.738; 59 -1.25,5.738; 60 -1.75,5.738; 61 -2.25,5.738; 62 -2.75,5.738; 63 -3.25,5.738; 64 -3.75,5.738
SON95P300X300X100-7N = smd 0.84 x 0.4: 1 -1.435,0.95; 2 -1.435,0; 3 -1.435,-0.95; 4 1.435,-0.95; 5 1.435,0; 6 1.435,0.95 | smd 1.625 x 2.365: 7 0,0
LL3301FF065QJ = smd 2.1 x 1.4: 1 -3,2.25; 2 3,2.25; 3 -3,-2.25; 4 3,-2.25
DQD8_1P2X0P4 = smd 0.5 x 0.2: 1 -0.625,0.6; 2 -0.625,0.2; 3 -0.625,-0.2; 4 -0.625,-0.6; 5 0.625,-0.6; 6 0.625,-0.2; 7 0.625,0.2; 8 0.625,0.6 | smd 0.4 x 1.2: 9 0,0
DIOM5226X223N = smd 2.4 x 1.55: 1 -2.1,0; 2 2.1,0
MICRO_QFN-8L_STM = smd 0.61 x 0.203: 1 -0.5,0.675; 2 -0.5,0.225; 3 -0.5,-0.225; 4 -0.5,-0.675; 5 0.5,-0.675; 6 0.5,-0.225; 7 0.5,0.225; 8 0.5,0.675
ECSTXO3225MV400TR = smd 1.3 x 1.1: 1 -1.15,-0.95; 2 1.15,-0.95; 3 1.15,0.95; 4 -1.15,0.95

### Placement (x,y rotation side)
AIRSPEED  69.98,24.13 270 top
BAROMETER  34.16,37.34 90 top
C1  31.75,38.48 90 top
C2  30.48,35.69 90 top
C3  60.07,25.02 270 top
C4  62.61,35.18 270 top
C5  50.55,36.07 270 top
C6  24.77,39.88 0 top
C7  20.7,37.59 270 top
C8  24,33.02 180 top
C9  23.88,31.37 180 top
C10  52.96,9.53 90 top
C11  55.12,9.02 0 top
C12  55.63,10.67 0 top
C13  57.53,7.62 90 top
C14  51.05,29.08 0 top
C15  45.97,17.65 180 top
C16  45.21,33.91 0 top
C17  34.8,33.66 0 top
C18  31.5,21.46 90 top
C19  51.05,27.18 180 top
C20  29.46,21.34 90 top
C21  49.28,20.57 270 top
C22  33.53,31.11 270 top
C23  59.94,12.7 270 top
C24  64.26,34.29 270 top
C25  15.49,24.13 180 top
C26  29.97,38.86 90 top
C27  55.63,12.7 0 top
C28  14.48,22.35 180 top
C29  1.52,12.45 90 top
D1  21.21,29.84 0 top
GPS  12.32,12.45 0 top
IMU  56.64,35.18 0 top
JP1  40.13,41.91 0 top
JP2  64.01,2.54 180 top
JP3  30.73,15.75 270 top
JP4  28.19,31.24 90 top
JP6  22.61,3.3 0 top
JP7  29.97,7.11 90 top
JST_CONNECTION  4.32,37.08 0 top
L1  48.77,30.73 270 top
L2  22.35,12.45 180 top
L3  55.12,39.88 180 top
L4  10.92,2.29 180 top
L5  22.35,14.22 180 top
L6  9.14,23.11 180 top
L7  27.69,36.58 90 top
L8  53.09,12.19 180 top
MAGNETOMETER  54.61,5.33 90 top
MICROCONTROLLER  41.4,25.78 180 top
POWER_MODULE  24.64,36.7 0 top
R1  40.01,35.56 90 top
R2  38.61,38.23 90 top
R3  24,29.72 0 top
R4  57.66,17.53 0 top
R5  38.86,6.86 270 top
R6  57.91,21.08 270 top
R7  57.4,24.64 270 top
R8  50.29,4.57 180 top
R9  59.94,9.14 180 top
R10  62.74,30.99 90 top
R11  51.31,23.11 180 top
R12  59.18,27.18 0 top
R13  57.91,30.73 0 top
R14  61.98,27.18 90 top
R16  45.21,38.86 0 top
R17  64.01,13.21 0 top
R18  48.01,15.49 0 top
S1  44.7,8.89 180 top
S2  70.87,8.64 0 top
U1  36.07,10.16 180 top
U$1  17.4,36.2 270 top
USB_COMM_MODE_FILTER  13.97,28.96 270 top
Y1  53.09,19.3 90 top

### Tracks (layer width: path | path; a pad name or v marks a point on that pad's centre or on a via)
3V3  (via drill 0.35)
  Top 0.203: MICROCONTROLLER.48 32.91,22.03 C18.1 31.5,19.56 30.73,18.8 v30.23,18.8 29.46,19.56 C20.1 | MICROCONTROLLER.1 48.72,22.03 C21.1 49.28,22.86 v49.02,23.11 | MICROCONTROLLER.19 44.15,33.7 C16.1 44.36,35.22 v44.45,35.31 | 33.95,33.36 34.54,32.77 36.58,32.77 36.83,33.02 37.33,33.02 37.65,32.7 MICROCONTROLLER.32 | 33.95,33.36 C17.1 32.64,33.66 v32.51,33.53 | C22.1 33.53,32.94 33.95,33.36 | 24.58,31.5 C9.1 | 24.46,29.84 R3.2 | C10.1 52.96,8.76 53.21,8.76 53.85,8.13 53.85,6.1 MAGNETOMETER.10 | MICROCONTROLLER.64 45.21,19.98 45.21,18.8 45.47,18.54 46.48,18.54 46.82,18.2 C15.1 46.95,17.78 v48.01,17.78 | L1.1 v48.77,32.26 | v52.32,16.26 52.14,16.44 Y1.4 | C10.1 52.96,8.26 v52.32,7.62 | MAGNETOMETER.3 54.86,3.55 v54.61,3.3 | R4.2 58.51,18.2 v57.91,18.8 R6.2 | S1.1 47.74,6.6 | v50.04,6.1 49.53,6.6 47.74,6.6 | S1.2 41.7,5.39 42.16,4.93 47.35,4.93 47.75,5.33 47.75,6.59 47.74,6.6 | AIRSPEED.2 60.71,21.5 60.71,22.35 60.07,22.99 C3.2 58.87,24.44 v58.67,24.64 57.82,25.49 R7.1 | R9.1 60.79,7.71 v60.45,7.37 | R8.2 48.39,4.57 v47.75,3.93 | BAROMETER.2 36.59,37.66 v36.83,37.9 36.83,38.35 37.34,38.86 38.55,38.86 R2.2 38.66,38.86 39.88,38.86 40.01,38.73 R1.2 | BAROMETER.5 32.93,35.85 32.42,35.85 31.5,34.93 v31.5,34.54 31.04,34.54 C2.1 | BAROMETER.6 32.75,36.32 32.26,36.32 31.04,35.11 C2.1 | USB_COMM_MODE_FILTER.1 14.64,31.66 v15.24,32.26 | C10.1 52.02,8.95 51.82,9.14 51.82,11.32 L8.2 | IMU.11 52.44,34.68 51.56,35.56 51.56,36.32 51.24,36.65 C5.1 | C5.1 50.55,38.61 51.82,39.88 L3.2 | GPS.2 2.84,14.35 C29.2 | C29.2 1.71,13.03 2.29,12.45 GPS.3 | C29.2 1.52,20.57 4.06,23.11 L6.2 8.75,23.76 v8.64,23.88
  Top 0.203: C2.1 30.23,35.11 29.46,35.87 28,35.87 L7.1 | C5.1 49.85,37.34 v49.85,37.91 | JP2.1 v72.39,2.54
  Top 0.305: 24.58,31.5 C8.1 24.89,33.02 26.04,34.16 26.04,35.72 POWER_MODULE.4 | C9.1 24.46,29.84 | R3.2 25.91,29.72 v26.16,29.97
  pour Route15: 0,44.45 76.2,44.45 76.2,0 0,0
5V
  Top 0.203: 20.58,38.3 C7.1
  Top 0.305: POWER_MODULE.6 26.07,38.7 25.91,38.86 24.38,38.86 24.18,39.06 C6.1 | C6.1 21.34,39.88 20.7,39.24 C7.1 21.77,38.17 22.29,37.65 POWER_MODULE.1 | U$1.1 20.58,38.3 | C6.1 24.18,40.7 25.4,41.91 JP1.1
5V_IN
  Top 0.305: U$1.2 16.64,33.33 12.64,33.33 11.82,34.16 JST_CONNECTION.4
BOOT0
  Top 0.203: 43.94,12.7 47.24,12.7 47.7,12.24 S1.3 | 43.94,12.7 42.42,12.7 41.7,11.99 S1.4 41.67,11.18 41.15,11.18 38.86,8.89 R5.1 | MICROCONTROLLER.60 43.15,13.49 43.94,12.7
CSB_ACCEL  (via drill 0.35)
  Top 0.203: IMU.14 53.99,36.18 52.83,37.34 v51.56,37.34 | v56.9,28.98 56.92,28.96 59.18,28.96 59.76,28.38 R12.2
  Bottom 0.203: v51.56,37.34 51.71,37.19 51.71,31.6 54.36,28.96 56.87,28.96 v56.9,28.98
CSB_GYRO  (via drill 0.35)
  Top 0.203: IMU.5 v61.35,34.68 | R13.2 v59.94,30.73
  Bottom 0.203: v61.35,34.68 61.35,33.54 60.33,32.52 60.33,31.12 v59.94,30.73
DN
  Top 0.203: USB_COMM_MODE_FILTER.2 14.2,32.03 13.72,32.51 10.16,32.51 9.32,33.35 JST_CONNECTION.3
DP
  Top 0.203: USB_COMM_MODE_FILTER.3 13.72,29.48 13.72,29.97 13.21,30.48 8.89,30.48 6.82,32.55 JST_CONNECTION.2
EXTI0  (via drill 0.35)
  Top 0.203: IMU.16 56.64,38.35 57.28,38.99 v59.44,38.99 | R14.2 62.92,28.7 v63.25,28.7
  Bottom 0.203: v63.25,28.7 65.79,31.25 65.79,37.58 64.39,38.99 v59.44,38.99
EXTI2  (via drill 0.35)
  Top 0.203: IMU.12 53.08,35.18 v52.9,35.36 | v48.51,39.62 48.33,39.62 47.57,38.86 R16.2
  Bottom 0.203: v52.9,35.36 52.9,35.63 53.34,36.07 53.34,38.35 52.07,39.62 v48.51,39.62
EXTI3
  Top 0.203: R17.2 73.15,13.21 74.38,14.43 AIRSPEED.5
EXTI4  (via drill 0.35)
  Top 0.203: MAGNETOMETER.7 55.36,7.1 v55.88,7.62 | R18.2 50.04,15.49 v50.29,15.24
  Bottom 0.203: v55.88,7.62 53.34,7.62 52.32,6.6 51.82,6.6 50.29,8.13 v50.29,15.24
GND  (via drill 0.35)
  Top 0.203: GPS.11 v21.83,8.65 v21.84,8.64 | GPS.10 16.12,3.17 v16,3.05 | v2.41,10.67 2.48,10.6 | 2.48,10.6 2.53,10.55 GPS.4 | GPS.20 8.52,20.44 v6.6,22.35 5.72,21.47 GPS.1 2.67,16.25 v2.41,16.51 | GPS.6 8.52,3.04 v8.64,2.92 | C20.2 29.46,23.88 v29.97,24.38 30.99,24.38 31.5,23.88 C18.2 31.71,22.53 MICROCONTROLLER.47 | v32.77,34.8 35.31,34.8 35.56,34.54 35.56,33.74 C17.2 37.71,33.66 38.15,33.21 MICROCONTROLLER.31 | C22.2 32.55,30.27 v32.51,30.23 | GPS.16 16.26,19.18 v16.26,22.35 C28.1 16.34,23.64 C25.1 | GPS.15 21.21,18.54 v22.1,18.54 | GPS.5 v2.3,8.65 v2.29,8.64 | C21.2 v49.28,18.54 | v45.21,16.51 45.12,16.6 C15.2 44.65,18.12 MICROCONTROLLER.63 | MICROCONTROLLER.18 44.65,32.71 44.7,32.77 45.72,32.77 46.06,33.11 C16.2 46.86,33.91 v47.5,33.27 | C14.2 51.9,27.23 C19.1 | C19.1 v53.09,27.18 | MICROCONTROLLER.12 48.92,27.53 49.02,27.43 49.02,26.67 49.53,26.16 51.82,26.16 51.95,26.3 C19.1 | Y1.2 54.04,23.05 v54.1,23.11 | MAGNETOMETER.6 55.62,5.58 56.64,6.6 56.64,8.13 56.98,8.47 C13.2 57.53,9.53 v57.4,9.65 | v57.4,9.65 56.9,9.65 56.26,9.02 C11.2 55.7,8.45 55.37,8.13 55.12,8.13 54.86,7.87 MAGNETOMETER.8 | v57.4,9.65 57.4,10.41 57.15,10.67 C12.2 C27.2 | C10.2 52.96,11.3 v53.09,11.43 | R5.2 38.86,4.83 v39.12,4.57 | v59.94,10.41 C23.2 | S2.3 67.83,6.35 v65.02,6.35 | C3.1 61.02,25.6 61.47,25.15 61.47,23.24 AIRSPEED.1 | IMU.6 60.71,34.18 61.09,33.8 61.81,33.8 C4.2 62.61,33.66 v62.23,33.27 64.1,33.27 C24.2 | v61.47,32.26 61.47,32.81 60.6,33.68 IMU.7 | BAROMETER.7 33.18,37.66 32.42,36.9 31.11,36.9 C2.2 29.52,36.27 v29.21,36.58 | USB_COMM_MODE_FILTER.5 13.29,28.03 v12.7,27.43 | C29.1 1.52,10.92 1.84,10.6 2.48,10.6
  Top 0.203: v26.67,41.15 27.34,40.47 29.21,40.47 C26.2 30.65,39.71 31.3,39.06 C1.2 32.31,39.62 34.54,39.62 34.89,39.28 BAROMETER.1 | C5.2 v50.55,34.29 | S2.4 73.87,4.62 v73.91,4.57 | JP2.2 v67.82,4.32 | IMU.4 60.45,35.18 61.09,35.82 v61.24,35.82 | USB_COMM_MODE_FILTER.8 14.64,27.95 14.91,27.69 16,27.69 v16.51,28.19 | U1.9 v36.07,8.38
  Top 0.305: POWER_MODULE.2 21.97,36.7 | v20.83,35.56 21.97,36.7 | C8.2 22.86,33.02 v21.84,34.04 | C9.2 22.23,31.37 21.84,31.75 v21.84,34.04 | C6.2 v26.67,39.88 | 21.97,36.7 21.66,37.01 C7.2 | D1.C 20.76,28.77 v21.08,28.45 | JST_CONNECTION.1 v4.32,33.02 | POWER_MODULE.7 24.64,35.05 23.88,34.29 22.1,34.29 v21.84,34.04 | JP1.2 35.05,39.88 35.31,39.62 v36.32,39.62
  pour Route2: 0,44.45 76.2,44.45 76.2,0 0,0
GPIO_EXTI0  (via drill 0.35)
  Top 0.152: MICROCONTROLLER.14 47.07,28.46 45.86,28.46 45.85,28.45
  Top 0.203: v45.47,27.94 45.47,28.06 45.85,28.45 | R14.1 61.29,26.6 v60.96,26.92
  Bottom 0.203: v60.96,26.92 60.96,27.69 60.55,28.09 45.62,28.09 v45.47,27.94
GPIO_EXTI1  (via drill 0.35)
  Top 0.203: MICROCONTROLLER.15 45.39,29.03 v45.21,29.21 | v27.18,21.59 27.18,19.56 v25.4,17.78 | v12.45,1.52 12.08,1.52 L4.1
  Bottom 0.203: v45.21,29.21 42.67,26.67 30.23,26.67 27.18,23.62 v27.18,21.59 | v25.4,17.78 24.13,16.51 24.13,2.29 23.37,1.52 v12.45,1.52
GPIO_EXTI2
  Top 0.203: MICROCONTROLLER.28 39.65,33.05 41.66,35.05 41.66,37.59 42.93,38.86 R16.1
GPIO_EXTI3  (via drill 0.35)
  Top 0.203: MICROCONTROLLER.11 45.83,27.03 45.47,26.67 v45.47,25.15 | v58.67,14.73 60.45,14.73 61.98,13.21 R17.1
  Bottom 0.203: v45.47,25.15 45.47,22.1 45.97,21.59 47.75,21.59 50.29,19.05 50.29,16.26 51.31,15.24 58.17,15.24 v58.67,14.73
GPIO_EXTI4  (via drill 0.35)
  Top 0.203: MICROCONTROLLER.20 43.69,31.48 v43.69,29.97 | v31.24,29.46 31.24,28.19 v33.78,25.65 | v49.53,17.27 49.02,16.76 47.75,16.76 47.43,16.44 R18.1
  Bottom 0.203: v43.69,29.97 37.08,29.97 35.81,31.24 31.5,31.24 31.24,30.99 v31.24,29.46 | v33.78,25.65 34.8,24.64 42.16,24.64 v49.53,17.27
GPS_SAFEBOOT
  Top 0.203: GPS.8 12.32,3.43 13.46,2.29 21.59,2.29 JP6.1
I2C1_SCL
  Top 0.203: R8.1 51.05,4.48 51.05,11.18 49.02,13.21 44.96,13.21 43.65,14.51 MICROCONTROLLER.61 | MAGNETOMETER.1 53.85,4.57 R8.1 | R8.1 51.14,3.47 52.07,2.54 JP2.6
I2C1_SDA
  Top 0.203: MAGNETOMETER.4 57.16,4.58 58.67,6.1 | 58.67,6.1 59.09,6.52 R9.2 59.09,12.28 57.4,13.97 44.7,13.97 44.15,14.52 MICROCONTROLLER.62 | 58.67,6.1 60.2,4.57 JP2.5
I2C2_SCL
  Top 0.203: BAROMETER.4 37.3,36.36 38.68,34.98 R1.1 | MICROCONTROLLER.29 39.15,33.31 40.01,34.16 R1.1 | R1.1 40.08,35.05 40.89,35.05 41.15,35.31 41.15,38.86 40.13,39.88 JP1.4
I2C2_SDA  (via drill 0.35)
  Top 0.203: v38.1,34.29 38.65,33.74 MICROCONTROLLER.30 | v38.67,36.13 38.61,36.2 38.61,37.59 | 38.61,37.59 R2.1 | 38.61,37.59 38.03,37.01 BAROMETER.3 | v37.59,39.62 JP1.3
  Bottom 0.203: v38.1,34.29 38.1,35.56 v38.67,36.13 37.59,37.22 v37.59,39.62
I2C3_SCL  (via drill 0.35)
  Top 0.203: MICROCONTROLLER.8 48.64,25.53 49.28,24.89 54.61,24.89 57.57,21.93 R6.1 59.44,20.41 59.44,16.76 v59.69,16.51 60.67,15.53 AIRSPEED.4 | v61.98,6.6 62.74,5.84 JP2.4
  Bottom 0.203: v59.69,16.51 59.69,12.7 61.98,10.41 v61.98,6.6
I2C3_SDA  (via drill 0.35)
  Top 0.203: MICROCONTROLLER.9 48.9,26.03 49.4,25.53 54.99,25.53 56.73,23.79 R7.2 58,23.79 59.94,21.84 59.94,18.54 v60.45,18.03 v60.46,18.03 AIRSPEED.3 | v62.74,8.64 63.75,7.62 63.75,6.1 65.28,4.57 JP2.3
  Bottom 0.203: v60.45,18.03 60.45,13.46 62.74,11.18 v62.74,8.64
IMU_INT2  (via drill 0.35)
  Top 0.203: R10.2 64.26,31.84 65.28,32.85 65.28,36.46 v64.91,36.83 | v61.21,37.85 60.05,36.68 IMU.1
  Bottom 0.203: v61.21,37.85 63.89,37.85 v64.91,36.83
IMU_INT4  (via drill 0.35)
  Top 0.203: IMU.13 53.73,35.68 52.84,36.57 v52.59,36.57 | v61.21,29.72 61.63,30.14 R10.1
  Bottom 0.203: v52.59,36.57 52.07,36.05 52.07,32 54.36,29.72 v61.21,29.72
N$1
  Top 0.203: Y1.3 52.14,22.87 R11.1
N$2
  Top 0.203: GPS.7 10.42,2.4 L4.2
N$3  (via drill 0.35)
  Top 0.203: MICROCONTROLLER.40 37.72,26.03 v37.85,25.91 | v57.15,27.18 R12.1
  Bottom 0.203: v37.85,25.91 45.34,25.91 45.85,26.42 54.1,26.42 54.86,27.18 v57.15,27.18
N$4  (via drill 0.35)
  Top 0.203: MICROCONTROLLER.39 34.43,26.53 34.04,26.92 v34.04,27.43 | v51.82,30.48 52.07,30.73 R13.1
  Bottom 0.203: v34.04,27.43 42.42,27.43 46.48,31.5 49.53,31.5 50.55,30.48 v51.82,30.48
N$5
  Top 0.305: R3.1 21.79,29.72 D1.A
N$6
  Top 0.203: BAROMETER.8 31.45,38.31 31.04,37.9 C1.1 31.64,38.01 C26.1 27.94,38.01 27.69,37.76 L7.2
N$7
  Top 0.203: MAGNETOMETER.5 55.84,5.08 C13.1
N$8
  Top 0.203: C4.1 62.79,35.76 63.5,35.05 64.17,35.05 C24.1 | L3.1 60.96,39.88 62.61,38.23 C4.1 | IMU.3 59.81,35.68 60.96,36.83 61.47,36.83 62.58,35.72 C4.1
N$9
  Top 0.203: GPS.17 14.22,22.03 C28.2 13.9,22.61 | 13.9,22.61 13.9,23.38 C25.2 | L6.1 9.91,23.11 10.92,24.13 12.37,24.13 13.9,22.61
N$10
  Top 0.203: MAGNETOMETER.9 54.36,8.13 54.61,8.38 54.61,8.95 C11.1 54.54,9.58 54.78,9.82 C12.1 C27.1 53.85,12.7 53.48,12.33 L8.1
NRST  (via drill 0.35)
  Top 0.152: v37.98,11.94 37.98,11.31 37.43,10.76 U1.4
  Top 0.203: MICROCONTROLLER.7 48.38,25.03 49.02,24.39 49.96,24.39 49.96,24.38 54.1,24.38 56.81,21.68 R4.1 56.94,17.39 56.94,15.45 57.91,14.48 | S2.2 73.87,11.73 72.9,12.7 68.58,12.7 67.87,11.99 S2.1 67.83,10.92 61.98,10.92 61.21,11.68 61.21,13.21 60.87,13.55 C23.1 58.84,13.55 57.91,14.48 | 57.91,14.48 45.97,14.48 v45.47,14.99 | POWER_MODULE.3 22.29,35.75 19.3,32.77 v19.3,28.7 | v12.45,22.61 12.45,19.17 GPS.18
  Bottom 0.203: v45.47,14.99 41.02,14.99 v37.98,11.94 37.21,12.7 29.46,12.7 27.69,14.48 27.69,18.54 24.13,22.1 19.3,22.1 18.03,23.37 18.03,27.43 v19.3,28.7 18.17,28.7 12.45,22.98 v12.45,22.61
NRST_O
  Top 0.152: JP7.6 28.7,11.18 28.96,11.43 32.51,11.43 33.18,10.76 U1.5
OSC_IN
  Top 0.203: MICROCONTROLLER.5 49.81,24.03 R11.2
RX
  Top 0.203: GPS.14 21.84,14.35 L5.2
SPI1_MISO  (via drill 0.35)
  Top 0.203: MICROCONTROLLER.22 42.65,35.54 43.94,36.83 46.74,36.83 v47.75,35.81 | IMU.15 55.48,37.23 54.1,38.61 v51.56,38.61 | IMU.10 53.23,34.18 52.32,33.27 50.55,33.27 49.28,34.54 49.28,37.34 v48.26,38.35 | JP1.6 45.21,40.39 v44.7,39.88
  Bottom 0.203: v51.56,38.61 48.51,38.61 v48.26,38.35 47.75,37.85 v47.75,35.81 46.99,35.05 45.97,35.05 44.7,36.32 v44.7,39.88
SPI1_MOSI  (via drill 0.35)
  Top 0.203: MICROCONTROLLER.23 42.16,31.53 42.16,36.32 v42.67,36.83 43.18,37.34 48.01,37.34 48.77,36.58 48.77,34.29 50.55,32.51 53.09,32.51 54.25,33.68 IMU.9 | v42.67,39.62 JP1.5
  Bottom 0.203: v42.67,36.83 v42.67,39.62
SPI1_SCK  (via drill 0.35)
  Top 0.203: MICROCONTROLLER.21 43.15,35.28 43.94,36.07 v45.97,36.07 50.8,31.24 55.12,31.24 56.64,32.77 IMU.8 | v46.99,39.77 47.39,39.77 47.75,40.13 JP1.7
  Bottom 0.203: v45.97,36.07 45.97,38.76 v46.99,39.77
SPI2_MISO  (via drill 0.35)
  Top 0.203: MICROCONTROLLER.35 34.46,28.53 34.29,28.7 32.26,28.7 v32,28.45 | v30.36,31.23 29.73,31.23 29.72,31.24 JP4.2
  Bottom 0.203: v30.36,31.23 30.36,28.69 30.6,28.45 v32,28.45
SPI2_MOSI  (via drill 0.35)
  Top 0.203: MICROCONTROLLER.36 34.45,28.03 34.29,28.19 33.78,28.19 33.52,27.93 v33.03,27.93 | JP4.1 29.33,28.7 v30.23,27.81
  Bottom 0.203: v33.03,27.93 32.77,27.68 30.36,27.68 v30.23,27.81
SPI2_SCK
  Top 0.203: MICROCONTROLLER.34 34.47,29.03 34.29,29.21 32.51,29.21 31.75,29.97 31.75,32 29.97,33.78 JP4.3
SWCLK  (via drill 0.35)
  Top 0.152: v39.12,15.24 39.22,15.14 39.22,10.52 38.69,9.98 36.72,9.98 U1.2
  Top 0.203: MICROCONTROLLER.49 37.65,18.35 v37.59,18.29
  Bottom 0.203: v37.59,18.29 37.59,16.51 38.1,16 39.12,16 39.37,15.75 39.37,15.49 v39.12,15.24
SWCLK_O
  Top 0.152: JP7.3 33.43,7.11 33.68,7.37 33.68,9.54 34.09,9.96 U1.7
SWDIO  (via drill 0.35)
  Top 0.152: v34.8,14.73 37.85,14.73 38.86,13.72 38.86,11.17 38.08,10.38 36.72,10.38 U1.3
  Top 0.203: MICROCONTROLLER.46 32.9,23.03 v32.51,23.42
  Bottom 0.203: v32.51,23.42 33.02,22.91 33.02,16.51 v34.8,14.73
SWDIO_O
  Top 0.152: 31.28,9.69 33.33,9.69 33.99,10.36 U1.6
  Top 0.203: JP7.5 31.28,9.69
SWO
  Top 0.152: MICROCONTROLLER.55 40.65,13.22 39.62,12.19 39.62,10.16 39.05,9.58 36.72,9.58 U1.1
SWO_O
  Top 0.152: JP7.1 33.53,4.57 34.04,5.08 34.04,9.4 34.2,9.56 U1.8
TX
  Top 0.203: GPS.13 L2.2
USART1_RX  (via drill 0.35)
  Top 0.203: MICROCONTROLLER.59 42.65,17.12 42.42,16.89 v42.42,16 | JP7.4 27.18,7.11 26.67,7.62 26.67,10.67 27.78,11.78 34.54,11.78 35.4,11.78 36.83,13.21 v37.87,13.21
  Bottom 0.203: v42.42,16 41.91,15.49 40.89,15.49 38.35,12.95 38.12,12.95 v37.87,13.21
USART1_TX  (via drill 0.35)
  Top 0.203: MICROCONTROLLER.58 42.15,17.77 v41.91,17.53 | JP7.2 27.18,4.57 25.91,5.84 25.91,11.68 26.43,12.21 33.04,12.21 34.29,13.46 v35.81,13.46
  Bottom 0.203: v35.81,13.46 36.71,14.35 39.25,14.35 41.91,17.02 v41.91,17.53
USART3_RX
  Top 0.203: MICROCONTROLLER.52 39.15,17.56 37.85,16.26 36.07,16.26 35.31,17.02 JP3.1 29.21,17.02 28.19,18.03 27.57,18.03 23.76,14.22 L5.1
USART3_TX  (via drill 0.35)
  Top 0.203: MICROCONTROLLER.51 38.65,17.82 37.85,17.02 v36.58,17.02 | L2.1 24.13,12.45 26.16,14.48 JP3.2 33.02,14.48 v34.54,16
  Bottom 0.203: v34.54,16 35.56,17.02 v36.58,17.02
USB_DN
  Top 0.203: MICROCONTROLLER.44 34.13,24.03 31.24,26.92 14.73,26.92 14.2,27.46 USB_COMM_MODE_FILTER.7
USB_DP
  Top 0.203: USB_COMM_MODE_FILTER.6 13.74,27.15 14.73,26.16 30.73,26.16 33.37,23.53 MICROCONTROLLER.45
VREF
  Top 0.203: MICROCONTROLLER.13 48.86,28.03 49.02,28.19 49.02,28.7 49.4,29.08 C14.1 | C14.1 50.15,29.03 C19.2 | C14.1 50.2,30.06 49.92,30.34 L1.2

### Text on the board
tPlace: 1 | BAR | PWR | IMU | Project / Dragonfly / UCSB / Capstone | 1 | JST | AIR | GPS | 1 | RST | 1 | 1 | BOOT0 | MAG